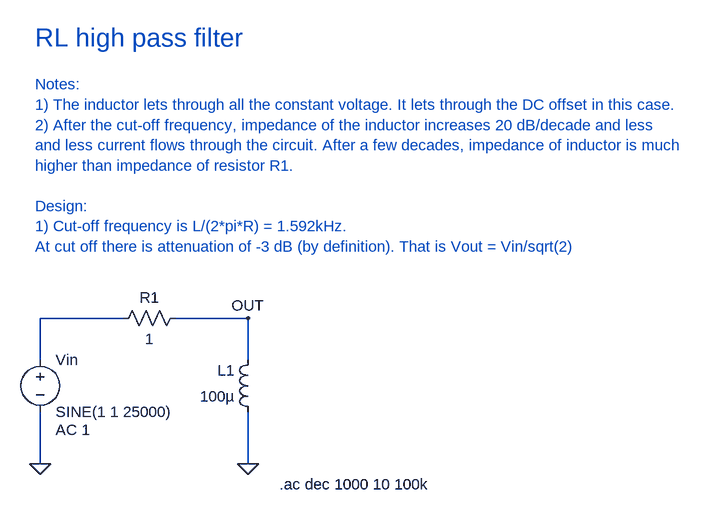
[diagram p0: schematic RL-highpass.asc]
RL-highpass.asc, the LTspice schematic file:
Version 4.1
SHEET 1 1168 680
WIRE 208 48 80 48
WIRE 400 48 288 48
WIRE 80 112 80 48
WIRE 400 112 400 48
WIRE 80 272 80 192
WIRE 400 272 400 192
FLAG 80 272 0
FLAG 400 272 0
FLAG 400 48 OUT
SYMBOL voltage 80 96 R0
WINDOW 123 24 124 Left 2
WINDOW 39 0 0 Left 2
SYMATTR Value2 AC 1
SYMATTR InstName Vin
SYMATTR Value SINE(1 1 25000)
SYMBOL ind 416 208 R180
WINDOW 0 36 80 Left 2
WINDOW 3 36 40 Left 2
SYMATTR InstName L1
SYMATTR Value 100µ
SYMBOL res 192 64 R270
WINDOW 0 32 56 VTop 2
WINDOW 3 0 56 VBottom 2
SYMATTR InstName R1
SYMATTR Value 1
TEXT 448 304 Left 2 !.ac dec 1000 10 100k
TEXT 72 -384 Left 4 ;RL high pass filter
TEXT 72 -312 Left 2 ;Notes:\n1) The inductor lets through all the constant voltage. It lets through the DC offset in this case.\n2) After the cut-off frequency, impedance of the inductor increases 20 dB/decade and less\nand less current flows through the circuit. After a few decades, impedance of inductor is much\nhigher than impedance of resistor R1. \n \nDesign:\n1) Cut-off frequency is L/(2*pi*R) = 1.592kHz.\nAt cut off there is attenuation of -3 dB (by definition). That is Vout = Vin/sqrt(2)

The netlist it stands for:
* RL-highpass.asc
Vin N001 0 SINE(1 1 25000) AC 1
L1 0 OUT 100µ
R1 N001 OUT 1
.ac dec 1000 10 100k
* RL high pass filter
* Notes:
* 1) The inductor lets through all the constant voltage. It lets through the DC offset in this case.
* 2) After the cut-off frequency, impedance of the inductor increases 20 dB/decade and less
* and less current flows through the circuit. After a few decades, impedance of inductor is much
* higher than impedance of resistor R1.
* Design:
* 1) Cut-off frequency is L/(2*pi*R) = 1.592kHz.
* At cut off there is attenuation of -3 dB (by definition). That is Vout = Vin/sqrt(2)
.backanno
.end